# Altium project PID_Project.PrjPcb
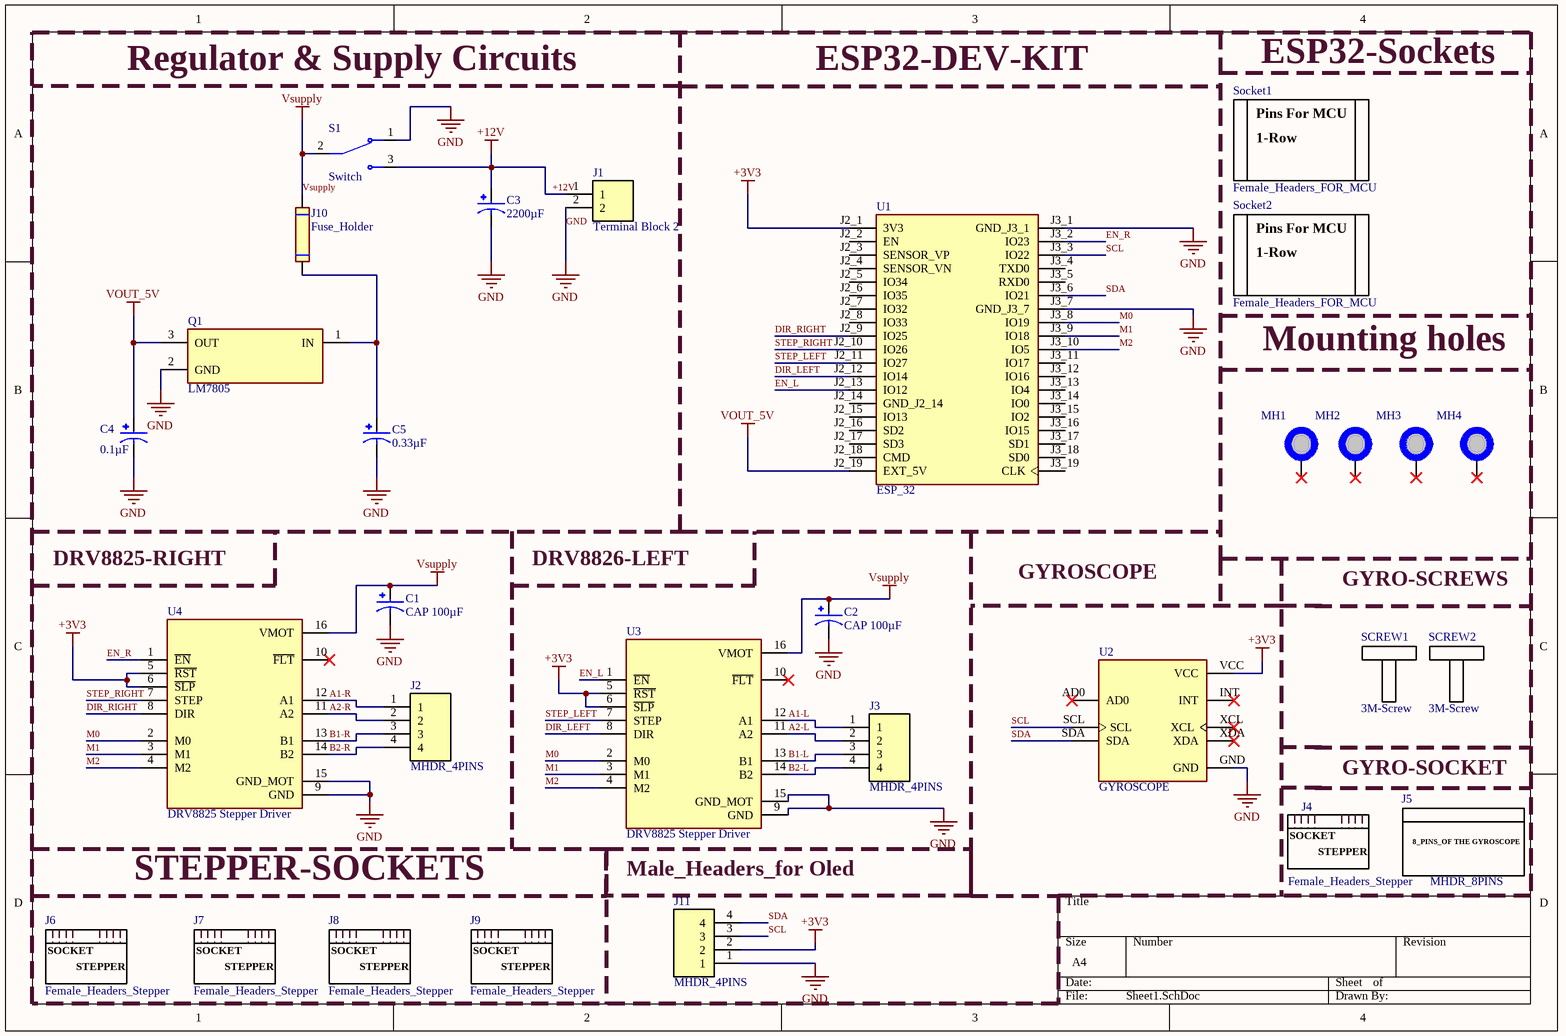
[diagram p0: Sheet1.SchDoc]
1 sheet, 30 parts. Net scope: global (net labels, ports and power ports of the same name join across sheets).
Board file: PCB1.PcbDoc

## Sheet Sheet1.SchDoc
size A4; SheetNumber: 1; SheetTotal: 1

### Parts
C1  CAP 100µF  [Cap_1µF]
C2  CAP 100µF  [Cap_1µF]
C3  2200µF  [CAP 2200UF]
C4  0.1µF  [CAP 0.1UF]
C5  0.33µF  [CAP 0.1UF]
J1  Terminal Block 2  [Terminal Block 2]
J2  MHDR_4PINS  [MHDR_4PINS]
J3  MHDR_4PINS  [MHDR_4PINS]
J4  Female_Headers_Stepper  [Female_STEPPER]
J5  MHDR_8PINS  [MHDR_8PINS]
J6  Female_Headers_Stepper  [Female_STEPPER]
J7  Female_Headers_Stepper  [Female_STEPPER]
J8  Female_Headers_Stepper  [Female_STEPPER]
J9  Female_Headers_Stepper  [Female_STEPPER]
J10  Fuse_Holder  [Fuse_Holder]
J11  MHDR_4PINS  [MHDR_4PINS]
MH1  MH_7.4MMNC_3.2MMD (NO COPPER-NPTH)  [MH_7.4MMC_3.2MMD_NO_COPPER_NPTH]  (value not drawn)
MH2  MH_7.4MMNC_3.2MMD (NO COPPER-NPTH)  [MH_7.4MMC_3.2MMD_NO_COPPER_NPTH]  (value not drawn)
MH3  MH_7.4MMNC_3.2MMD (NO COPPER-NPTH)  [MH_7.4MMC_3.2MMD_NO_COPPER_NPTH]  (value not drawn)
MH4  MH_7.4MMNC_3.2MMD (NO COPPER-NPTH)  [MH_7.4MMC_3.2MMD_NO_COPPER_NPTH]  (value not drawn)
Q1  LM7805  [LM7805]
S1  Switch  [Switch]
SCREW1  3M-Screw  [3M-SCREW]  (mechanical)
SCREW2  3M-Screw  [3M-SCREW]  (mechanical)
Socket1  Female_Headers_FOR_MCU  [Female_headers]
Socket2  Female_Headers_FOR_MCU  [Female_headers]
U1  ESP_32  [ESP_32]
U2  GYROSCOPE  [GYROSCOPE]
U3  DRV8825 Stepper Driver  [DRV8825 Stepper Driver]
U4  DRV8825 Stepper Driver  [DRV8825 Stepper Driver]

### Nets
+3V3: J11.2 U1.J2_1(3V3) U2.VCC U3.5(~{RST}) U3.6(~{SLP}) U4.5(~{RST}) U4.6(~{SLP})
+12V: C3.P J1.1 S1.3
GND: C1.N C2.N C3.N C4.N C5.N J1.2 J11.1 Q1.2(GND) S1.1 U1.J3_1(GND_J3_1) U1.J3_7(GND_J3_7) U2.GND U3.9(GND) U3.15(GND_MOT) U4.9(GND) U4.15(GND_MOT)
VOUT_5V: C4.P Q1.3(OUT) U1.J2_19(EXT_5V)
Vsupply: C1.P C2.P J10.2 S1.2 U3.16(VMOT) U4.16(VMOT)
A1-L: J3.1 U3.12(A1)
A1-R: J2.1 U4.12(A1)
A2-L: J3.2 U3.11(A2)
A2-R: J2.2 U4.11(A2)
B1-L: J3.3 U3.13(B1)
B1-R: J2.3 U4.13(B1)
B2-L: J3.4 U3.14(B2)
B2-R: J2.4 U4.14(B2)
DIR_LEFT: U1.J2_12(IO14) U3.8(DIR)
DIR_RIGHT: U1.J2_9(IO25) U4.8(DIR)
EN_L: U1.J2_13(IO12) U3.1(~{EN})
EN_R: U1.J3_2(IO23) U4.1(~{EN})
M0: U1.J3_8(IO19) U3.2(M0) U4.2(M0)
M1: U1.J3_9(IO18) U3.3(M1) U4.3(M1)
M2: U1.J3_10(IO5) U3.4(M2) U4.4(M2)
SCL: J11.3 U1.J3_3(IO22) U2.SCL
SDA: J11.4 U1.J3_6(IO21) U2.SDA
STEP_LEFT: U1.J2_11(IO27) U3.7(STEP)
STEP_RIGHT: U1.J2_10(IO26) U4.7(STEP)
NetC5_P: C5.P J10.1 Q1.1(IN)

Not connected (* = marked no-connect by the designer): MH1 1*; MH2 1*; MH3 1*; MH4 1*; U1 J2_2(EN) J2_3(SENSOR_VP) J2_4(SENSOR_VN) J2_5(IO34) J2_6(IO35) J2_7(IO32) J2_8(IO33) J2_14(GND_J2_14) J2_15(IO13) J2_16(SD2) J2_17(SD3) J2_18(CMD) J3_4(TXD0) J3_5(RXD0) J3_11(IO17) J3_12(IO16) J3_13(IO4) J3_14(IO0) J3_15(IO2) J3_16(IO15) J3_17(SD1) J3_18(SD0) J3_19(CLK); U2 AD0* INT* XCL* XDA*; U3 10(~{FLT})*; U4 10(~{FLT})*

### Notes on the sheet
- Regulator & Supply Circuits
- ESP32-DEV-KIT
- ESP32-Sockets
- هنا انت في الاغلب هتشيل المقاومه ال 3.3 و التانيه  2.2
  علشان لما تعملها علي بروتس هتلاقي ان ال  خرج ال  VOLTAGE REGUALTOR 5 VOLT  و وصله علي ال  ESP 32
  بقي
- Simulation on protues done
- Schematic Link :
  https://opendtu-onbattery.net/hardware/esp32_devkit/#overview
- Mounting holes
- DRV8825-RIGHT
- DRV8826-LEFT
- GYROSCOPE
- GYRO-SCREWS
- GYRO-SOCKET
- STEPPER-SOCKETS
- Male_Headers_for Oled
- (in symbol Female_Headers_FOR_MCU) Pins For MCU; 1-Row
- (in symbol Female_Headers_Stepper) SOCKET; STEPPER
- (in symbol MHDR_8PINS) 8_PINS_OF THE GYROSCOPE

### Library data of the parts
C3 = CAP 2200µF
C4 = CAP 0.1µF
C5 = CAP 0.33µF
MH1-MH4 = MH_7.4MMNC_3.2MMD_1